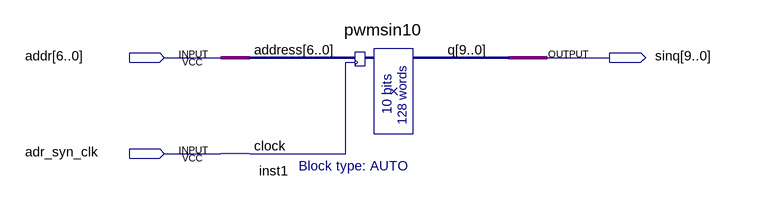
[diagram p0: schematic sheet]
// Quartus schematic pwmsin10.bdf as structural Verilog: 1 symbols, 3 pins
module pwmsin10 (
  input  [6:0] addr,
  input  adr_syn_clk,
  output [9:0] sinq
);

  pwmsin10 inst1 (.address(addr), .clock(adr_syn_clk), .q(sinq));
endmodule
